# EAGLE design Step-sch (EAGLE 9.3.0)
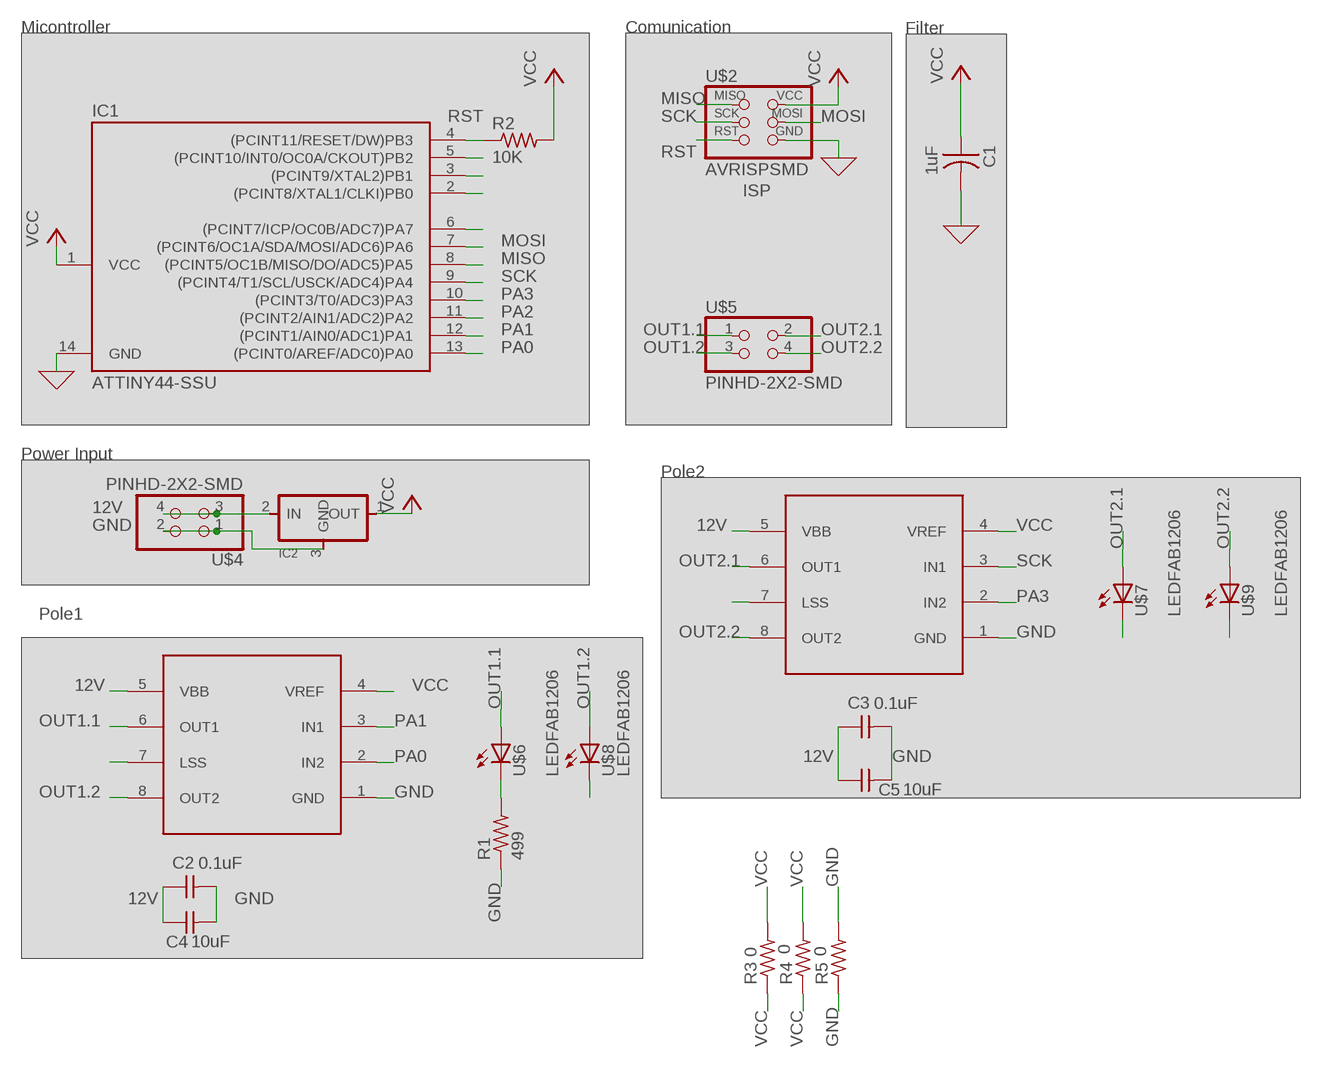
[diagram p0: schematic, sheet 1]

## Parts
C1  1uF  CAP-US1206FAB  [C1206FAB]
C2  0.1uF  CAP-UNPOLARIZEDFAB  [C1206FAB]
C3  0.1uF  CAP-UNPOLARIZEDFAB  [C1206FAB]
C4  10uF  CAP-UNPOLARIZEDFAB  [C1206FAB]
C5  10uF  CAP-UNPOLARIZEDFAB  [C1206FAB]
IC1  ATTINY44-SSU  [SOIC14]
IC2  REGULATORSOT23  [SOT23]
R1  499  RES-US1206FAB  [R1206FAB]
R2  10K  RES-US1206FAB  [R1206FAB]
R3  0  RES-US1206FAB  [R1206FAB]
R4  0  RES-US1206FAB  [R1206FAB]
R5  0  RES-US1206FAB  [R1206FAB]
U$1  A4953-H-BRIDGE-MOTOR-DRIVER  [SOIC8]
U$2  AVRISPSMD  [2X03SMD]
U$3  A4953-H-BRIDGE-MOTOR-DRIVER  [SOIC8]
U$4  PINHD-2X2-SMD  [2X02SMD]
U$5  PINHD-2X2-SMD  [2X02SMD]
U$6  LEDFAB1206  [LED1206FAB]
U$7  LEDFAB1206  [LED1206FAB]
U$8  LEDFAB1206  [LED1206FAB]
U$9  LEDFAB1206  [LED1206FAB]

## Nets
12V: C2.1 C3.1 C4.1 C5.1 IC2.2(IN) U$1.5(VBB) U$3.5(VBB) U$4.3 U$4.4
GND: C1.2 C2.2 C3.2 C4.2 C5.2 IC1.14(GND) IC2.3(GND) R1.1 R5.1 R5.2 U$1.1(GND) U$2.6(GND) U$3.1(GND) U$4.1 U$4.2
MISO: IC1.6((PCINT7/ICP/OC0B/ADC7)PA7) IC1.8((PCINT5/OC1B/MISO/DO/ADC5)PA5) U$2.1(MISO)
MOSI: IC1.7((PCINT6/OC1A/SDA/MOSI/ADC6)PA6) U$2.4(MOSI)
N$4: U$3.7(LSS)
N$5: IC1.5((PCINT10/INT0/OC0A/CKOUT)PB2)
N$6: IC1.3((PCINT9/XTAL2)PB1)
N$7: IC1.2((PCINT8/XTAL1/CLKI)PB0)
N$9: U$1.7(LSS)
OUT1.1: U$1.6(OUT1) U$5.1 U$6.1(A)
OUT1.2: U$1.8(OUT2) U$5.3 U$8.1(A)
OUT2.1: U$3.6(OUT1) U$5.2 U$7.1(A)
OUT2.2: U$3.8(OUT2) U$5.4 U$9.1(A)
PA0: IC1.13((PCINT0/AREF/ADC0)PA0) U$1.2(IN2)
PA1: IC1.12((PCINT1/AIN0/ADC1)PA1) U$1.3(IN1)
PA2: IC1.11((PCINT2/AIN1/ADC2)PA2)
PA3: IC1.10((PCINT3/T0/ADC3)PA3) U$3.2(IN2)
RES: R1.2 U$6.2(C) U$7.2(C) U$8.2(C) U$9.2(C)
RST: IC1.4((PCINT11/RESET/DW)PB3) R2.1 U$2.5(RST)
SCK: IC1.9((PCINT4/T1/SCL/USCK/ADC4)PA4) U$2.3(SCK) U$3.3(IN1)
VCC: C1.1 IC1.1(VCC) IC2.1(OUT) R2.2 R3.1 R3.2 R4.1 R4.2 U$1.4(VREF) U$2.2(VCC) U$3.4(VREF)

## Notes on the sheet
- Micontroller | Comunication | Filter
- ISP
- Power Input
- Pole2
- Pole1

## Library data of the parts
C1 = fab:CAP-US
C2-C5 = fab:CAP-UNPOLARIZED
IC1 = fab:ATTINY44
IC2 = fab:REGULATOR
R1-R5 = fab:RES-US: Resistor (US Symbol) Variants with postfix FAB are widened to allow the routing of internal traces
U$1 U$3 = fab:A4953-H-BRIDGE-MOTOR-DRIVER
U$2 = fab:AVRISP
U$4 U$5 = fab:PINHD-2X2-SMD
U$6-U$9 = fab:LED: LED

## Board
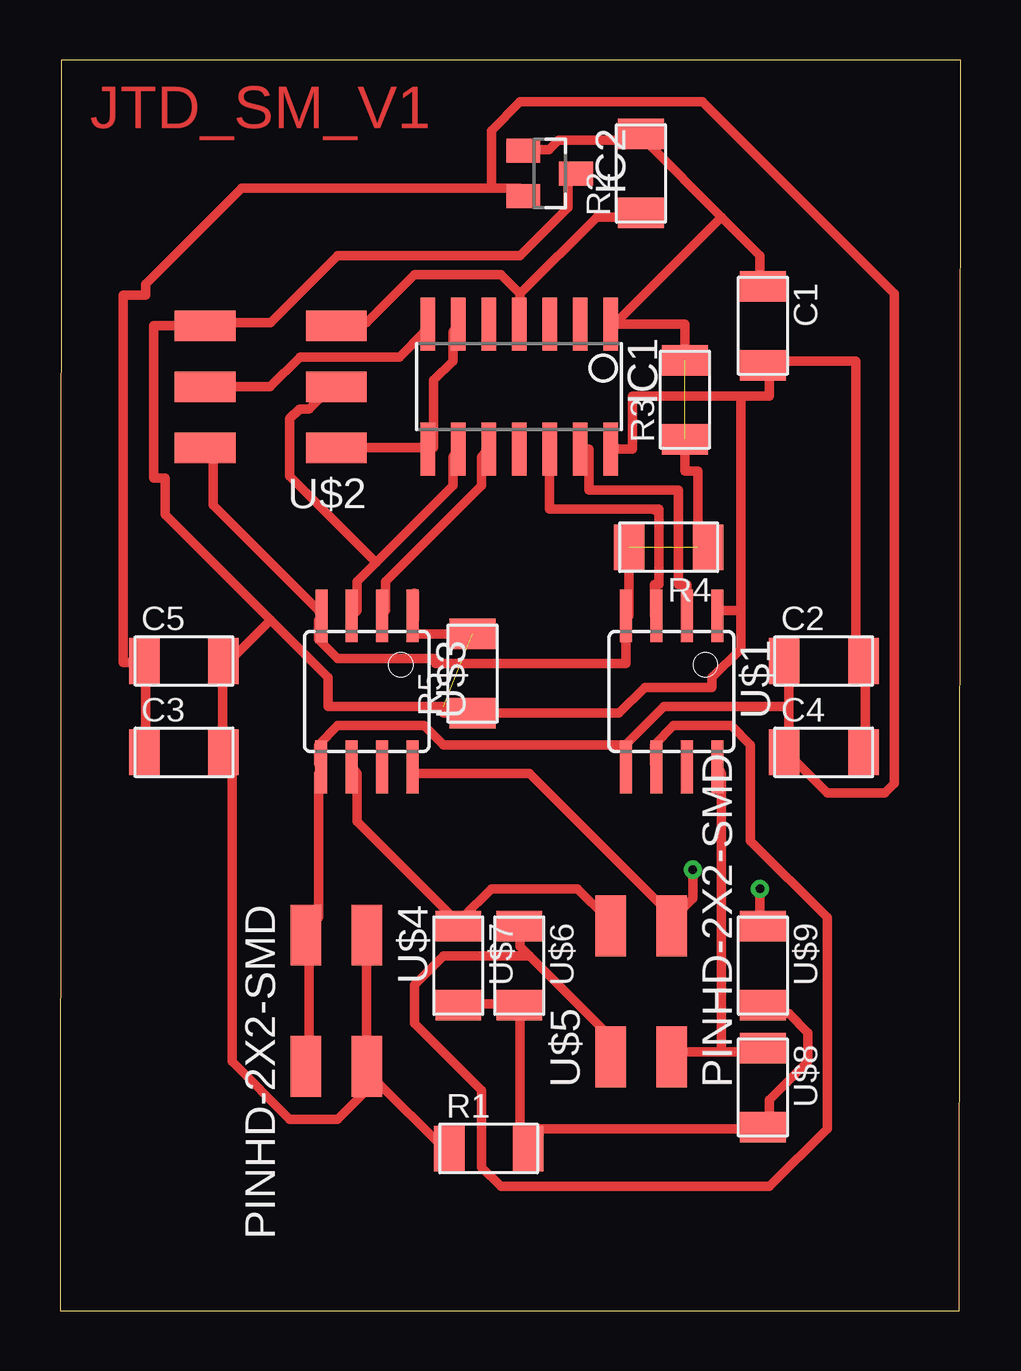
[diagram p1: board, top side]
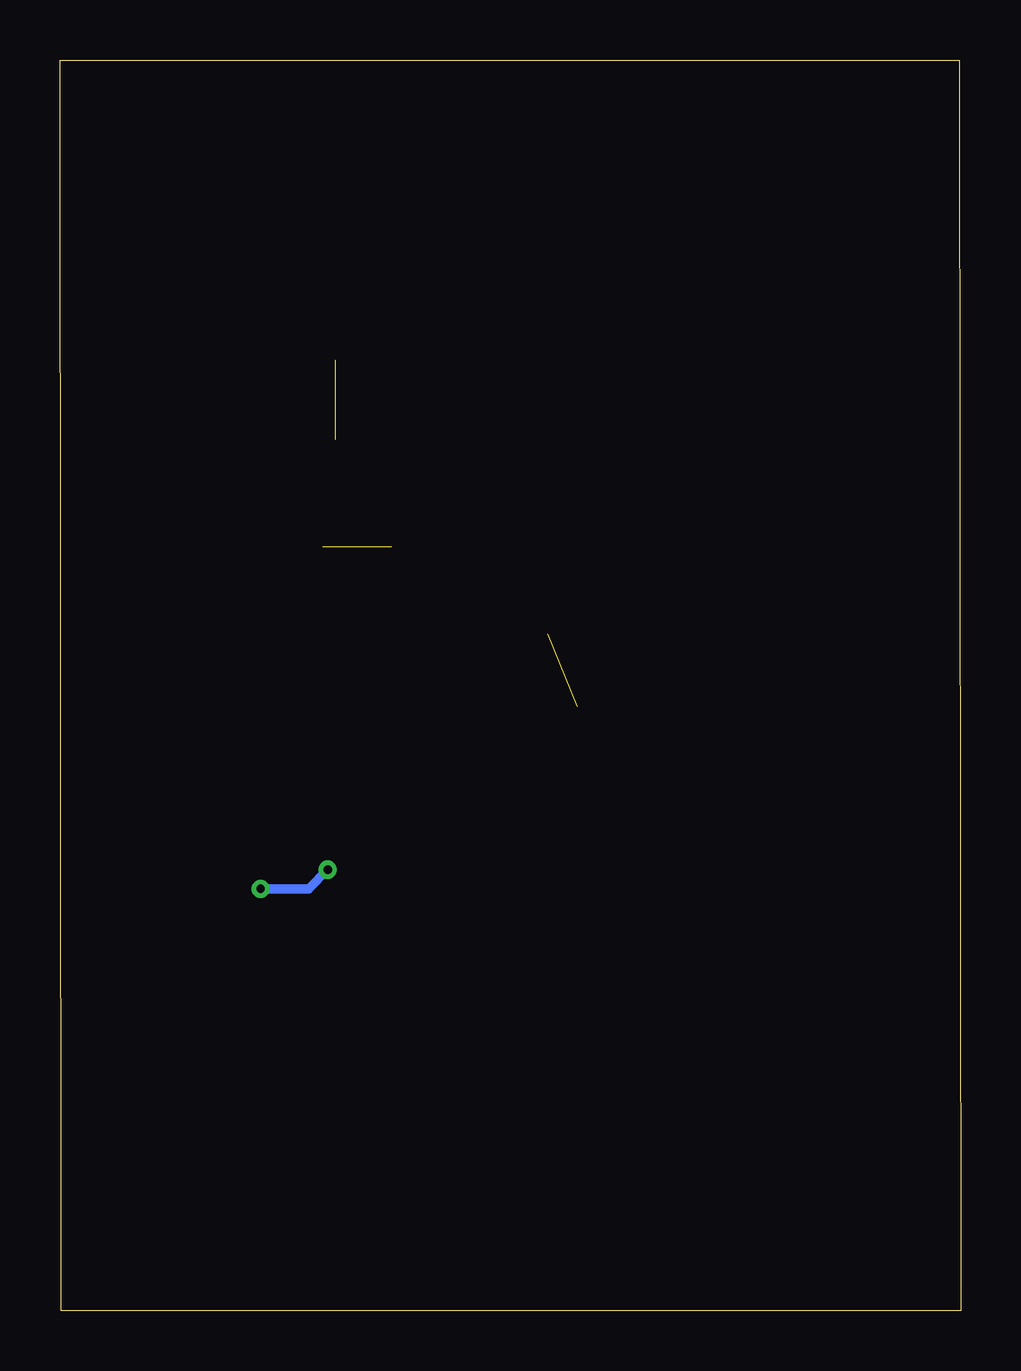
[diagram p2: board, bottom side, seen from below]

Size 37.54 x 52.13 mm. Coordinates in mm from the lower left corner, seen from the top.
Outline: 0,0 37.49,0 37.54,52.13 0.05,52.13 0,0
Copper layers (1*16): Top 0.035mm / dielectric 1.5mm / Bottom 0.035mm
Design rules "default *": minimum track width 0.4mm, minimum drill 0.35mm, track to track 0.4mm, track to pad 0.4mm, pad to pad 0.4mm, via to via 0.4mm, smd to smd 0.4mm, copper to edge 40mil, drill to drill 6mil, minimum pad ring 10mil, minimum via ring 8mil, stop-mask expansion 4mil, vias tented up to drill 0mil, thermal gap 10mil

### Footprints (pad centres in the part's own frame; a part is rotated, then mirrored left to right if it is on the bottom)
C1206FAB = smd 1.27 x 1.905: 1 -1.651,0; 2 1.651,0
SOIC14 = smd 0.61 x 2.21: 1 -3.81,-2.603; 2 -2.54,-2.603; 3 -1.27,-2.603; 4 0,-2.603; 5 1.27,-2.603; 6 2.54,-2.603; 7 3.81,-2.603; 8 3.81,2.603; 9 2.54,2.603; 10 1.27,2.603; 11 0,2.603; 12 -1.27,2.603; 13 -2.54,2.603; 14 -3.81,2.603
SOT23 = smd 1 x 1.4: 1 -0.95,-1.1; 2 0.95,-1.1; 3 0,1.1
R1206FAB = smd 1.27 x 1.905: 1 -1.651,0; 2 1.651,0
SOIC8 = smd 0.5 x 2.2: 1 -1.905,-3.154; 2 -0.645,-3.154; 3 0.625,-3.154; 4 1.895,-3.154; 5 1.905,3.154; 6 0.635,3.154; 7 -0.635,3.154; 8 -1.905,3.154
2X03SMD = smd 2.54 x 1.27: 1 -2.54,2.54; 2 2.92,2.54; 3 -2.54,0; 4 2.92,0; 5 -2.54,-2.54; 6 2.92,-2.54
2X02SMD = smd 2.54 x 1.27: 1 -2.54,1.27; 2 2.92,1.27; 3 -2.54,-1.27; 4 2.92,-1.27
LED1206FAB = smd 1.27 x 1.905: 1 -1.651,0; 2 1.651,0

### Placement (x,y rotation side)
C1  29.3,41.05 270 top
C2  31.84,27.08 0 top
C3  5.17,23.27 0 top
C4  31.84,23.27 0 top
C5  5.17,27.08 0 top
IC1  19.14,38.51 180 top
IC2  20.41,47.4 270 top
R1  17.87,6.76 0 top
R2  24.22,47.4 90 top
R3  26.06,37.97 90 top
R4  25.37,31.82 180 top
R5  17.2,26.56 90 top
U$1  25.49,25.81 180 top
U$2  8.98,38.51 180 top
U$3  12.79,25.81 180 top
U$4  11.52,13.11 270 top
U$5  24.22,13.11 90 top
U$6  19.14,14.38 270 top
U$7  16.6,14.38 270 top
U$8  29.3,9.3 270 top
U$9  29.3,14.38 270 top

### Tracks (layer width: path | path; a pad name or v marks a point on that pad's centre or on a via)
12V
  Top 0.4: 30.38,25.18 30.38,26.78 C2.1 | 30.38,25.18 30.38,23.58 C4.1 30.38,23.18 31.98,21.58 34.38,21.58 34.78,21.98 34.78,42.38 26.78,50.38 19.18,50.38 17.98,49.18 17.98,46.78 | 23.58,23.58 23.58,22.78 U$1.5 23.58,23.58 | 23.58,23.58 25.18,25.18 30.38,25.18 | U$4.4 10.38,10.38 10.38,15.58 U$4.3 10.38,15.98 10.78,16.38 10.78,22.38 U$3.5 10.78,22.78 10.78,23.58 11.58,24.38 15.18,24.38 15.98,23.58 23.58,23.58 | C3.1 3.58,23.58 3.58,26.78 3.54,27.01 | 3.54,27.01 C5.1 3.58,27.18 | 17.98,46.78 7.58,46.78 3.58,42.78 3.58,42.32 2.63,42.32 2.63,27.01 3.54,27.01 | 17.98,46.78 19.18,46.78 IC2.2
GND  (1 unrouted)
  Top 0.4: C4.2 33.58,23.58 33.58,26.78 C2.2 33.18,27.18 33.18,39.58 29.58,39.58 | 13.18,9.58 12.78,9.98 U$4.2 | 13.18,9.58 15.98,6.78 R1.1 | U$4.1 12.78,15.58 12.78,10.38 U$4.2 | 13.18,9.58 11.58,7.98 9.58,7.98 7.18,10.38 7.18,23.18 C3.2 6.78,23.58 6.78,26.78 C5.2 7.18,27.18 8.78,28.78 | 13.18,9.58 U$4.2 | 8.78,28.78 11.18,26.38 11.18,25.18 15.98,25.18 15.98,24.91 R5.1 23.3,24.91 24.38,25.98 27.18,25.98 27.18,26.38 28.38,27.58 28.38,29.18 | 29.18,39.18 C1.2 29.58,39.58 | 23.18,35.98 IC1.14 23.86,35.91 23.86,38.12 28.38,38.12 | 28.38,29.18 27.58,29.18 U$1.1 | IC2.3 21.18,47.18 21.18,45.98 19.18,43.98 11.58,43.98 8.78,41.18 6.38,41.18 U$2.6 3.9,41.05 3.9,34.7 4.38,34.7 4.38,33.18 8.78,28.78 | 14.78,29.92 14.78,28.78 U$3.1 14.7,28.21 R5.2 | 29.58,39.58 29.58,38.12 28.38,38.12 | 28.38,29.18 28.38,38.12
MISO
  Top 0.4: IC1.6 16.38,40.78 16.38,39.58 15.58,38.78 15.58,35.98 IC1.8 15.18,35.98 11.58,35.98 U$2.1
MOSI
  Top 0.4: IC1.7 15.18,40.78 14.15,39.75 10,39.75 8.77,38.51 U$2.4
OUT1.1
  Top 0.4: 19.58,14.78 22.78,11.58 22.78,10.78 U$5.1 | 19.58,14.78 19.18,15.18 19.18,15.98 U$6.1 | 19.58,14.78 15.98,14.78 14.78,13.58 14.78,11.98 17.58,9.18 17.58,5.98 18.38,5.18 29.58,5.18 31.98,7.58 31.98,16.38 28.78,19.58 28.78,23.58 27.98,24.38 25.58,24.38 24.78,23.58 24.78,22.78 U$1.6
OUT1.2
  Top 0.4: 27.58,10.78 25.58,10.78 U$5.3 | 27.58,10.78 29.18,10.78 U$8.1 | 27.58,10.78 27.58,22.38 U$1.8
OUT2.1
  Top 0.4: U$5.2 22.78,16.38 21.58,17.58 17.98,17.58 16.78,16.38 U$7.1 16.38,16.38 12.38,20.38 12.38,22.38 U$3.6
OUT2.2  (via drill 0.35)
  Top 0.4: v29.18,17.58 29.18,16.38 U$9.1 | v26.38,18.38 26.38,17.18 25.58,16.38 | 25.58,16.38 19.58,22.38 14.78,22.38 U$3.8 | 25.58,16.38 U$5.4
  Bottom 0.4: v29.18,17.58 27.18,17.58 v26.38,18.38
PA0
  Top 0.4: U$1.2 26.14,30.27 25.79,30.27 25.79,34.2 22.05,34.2 22.05,35.91 IC1.13
PA1
  Top 0.4: 20.38,35.58 IC1.12 20.41,33.4 24.78,33.4 | 24.78,33.4 24.96,33.4 | U$1.3 24.78,28.96 24.78,30.27 24.96,30.27 24.96,33.38 24.78,33.38 24.78,33.4
PA3
  Top 0.4: U$3.2 13.58,29.18 13.58,30.38 17.58,34.38 17.58,35.58 IC1.10
RES
  Top 0.4: U$9.2 29.58,12.38 30.38,12.38 31.18,11.58 31.18,10.38 29.58,8.78 29.58,7.98 U$8.2 29.18,7.58 19.18,7.58 | U$7.2 16.78,12.78 18.78,12.78 U$6.2 19.18,12.38 19.18,7.58 | 19.18,7.58 19.18,6.78 R1.2 19.18,7.58
RST
  Top 0.4: 19.18,42.38 19.18,41.18 IC1.4 | 19.18,42.38 22.38,45.58 23.91,45.58 R2.1 | 19.18,42.38 18.38,43.18 14.78,43.18 12.78,41.18 11.58,41.18 U$2.5
SCK
  Top 0.4: 13.18,31.18 16.38,34.38 16.38,35.58 IC1.9 | 13.18,31.18 12.38,30.38 12.38,29.18 U$3.3 | 13.18,31.18 9.58,34.78 9.58,37.18 9.98,37.58 10.38,37.58 11.18,38.38 U$2.3
VCC  (2 unrouted)
  Top 0.4: C1.1 29.18,42.78 29.18,43.98 27.58,45.58 | 27.58,45.58 23.18,41.18 IC1.1 26.05,41.12 R3.2 | 23.58,28.78 U$1.4 | IC2.1 19.58,48.38 20.38,48.38 20.78,48.78 23.91,48.78 R2.2 24.38,48.78 27.58,45.58 | U$2.2 6.38,35.58 6.38,33.58 10.78,29.18 U$3.4 10.78,28.78 10.78,27.98 11.58,27.18 15.65,27.18 15.65,26.97 23.6,26.97 U$1.4 | R3.1 26.05,35 26.59,35 26.59,31.82 R4.1 | R4.2 23.72,28.96 U$1.4

### Text on the board
Top: JTD_SM_V1